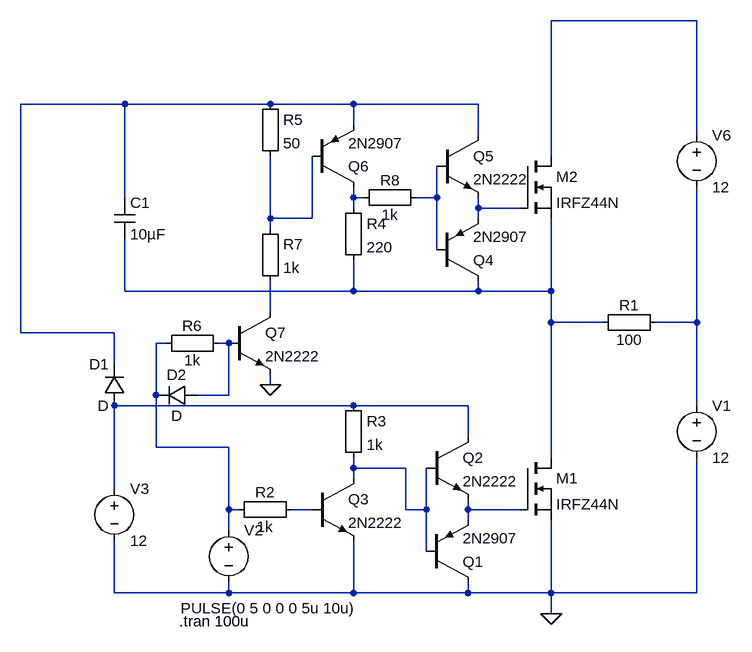
[diagram p0: schematic Drive6.asc]
Drive6.asc, the LTspice schematic file:
Version 4
SHEET 1 880 1388
WIRE -2688 448 -2912 448
WIRE -3568 576 -3728 576
WIRE -3344 576 -3568 576
WIRE -3216 576 -3344 576
WIRE -3024 576 -3216 576
WIRE -3216 608 -3216 576
WIRE -3024 624 -3024 576
WIRE -2688 624 -2688 448
WIRE -2912 656 -2912 448
WIRE -3568 720 -3568 576
WIRE -3216 720 -3216 704
WIRE -3200 720 -3216 720
WIRE -3088 720 -3088 672
WIRE -3088 720 -3120 720
WIRE -3216 736 -3216 720
WIRE -3024 736 -3024 720
WIRE -2960 736 -3024 736
WIRE -3344 752 -3344 656
WIRE -3280 752 -3280 656
WIRE -3280 752 -3344 752
WIRE -3024 752 -3024 736
WIRE -3344 768 -3344 752
WIRE -3088 800 -3088 720
WIRE -3568 864 -3568 784
WIRE -3216 864 -3216 816
WIRE -3216 864 -3568 864
WIRE -3024 864 -3024 848
WIRE -3024 864 -3216 864
WIRE -2912 864 -2912 752
WIRE -2912 864 -3024 864
WIRE -3344 896 -3344 848
WIRE -2912 912 -2912 864
WIRE -2832 912 -2912 912
WIRE -2688 912 -2688 704
WIRE -2688 912 -2752 912
WIRE -3728 928 -3728 576
WIRE -3584 928 -3728 928
WIRE -3504 944 -3520 944
WIRE -3408 944 -3424 944
WIRE -3584 976 -3584 928
WIRE -3344 1008 -3344 992
WIRE -3520 1024 -3520 944
WIRE -3408 1024 -3408 944
WIRE -3408 1024 -3456 1024
WIRE -3216 1040 -3584 1040
WIRE -3040 1040 -3216 1040
WIRE -2688 1040 -2688 912
WIRE -3040 1088 -3040 1040
WIRE -3520 1104 -3520 1024
WIRE -3408 1104 -3520 1104
WIRE -2912 1120 -2912 912
WIRE -3216 1136 -3216 1120
WIRE -3136 1136 -3216 1136
WIRE -3216 1152 -3216 1136
WIRE -3584 1168 -3584 1040
WIRE -3408 1200 -3408 1104
WIRE -3392 1200 -3408 1200
WIRE -3280 1200 -3312 1200
WIRE -3136 1200 -3136 1136
WIRE -3104 1200 -3104 1136
WIRE -3104 1200 -3136 1200
WIRE -3040 1200 -3040 1184
WIRE -2960 1200 -3040 1200
WIRE -3040 1216 -3040 1200
WIRE -3408 1232 -3408 1200
WIRE -3104 1264 -3104 1200
WIRE -3584 1328 -3584 1248
WIRE -3408 1328 -3408 1312
WIRE -3408 1328 -3584 1328
WIRE -3216 1328 -3216 1248
WIRE -3216 1328 -3408 1328
WIRE -3040 1328 -3040 1312
WIRE -3040 1328 -3216 1328
WIRE -2912 1328 -2912 1216
WIRE -2912 1328 -3040 1328
WIRE -2688 1328 -2688 1120
WIRE -2688 1328 -2912 1328
WIRE -2912 1360 -2912 1328
FLAG -2912 1360 0
FLAG -3344 1008 0
SYMBOL nmos -2960 1120 R0
SYMATTR InstName M1
SYMATTR Value IRFZ44N
SYMBOL voltage -2688 1024 R0
WINDOW 123 0 0 Left 0
WINDOW 39 0 0 Left 0
SYMATTR InstName V1
SYMATTR Value 12
SYMBOL Misc\\EuropeanResistor -2736 896 R90
WINDOW 0 5 56 VBottom 2
WINDOW 3 27 56 VTop 2
SYMATTR InstName R1
SYMATTR Value 100
SYMBOL Misc\\EuropeanResistor -3408 1216 R270
WINDOW 0 27 56 VTop 2
WINDOW 3 5 56 VBottom 2
SYMATTR InstName R2
SYMATTR Value 1k
SYMBOL voltage -3408 1216 R0
WINDOW 3 -74 136 Left 2
WINDOW 123 0 0 Left 0
WINDOW 39 0 0 Left 0
SYMATTR InstName V2
SYMATTR Value PULSE(0 5 0 0 0 5u 10u)
SYMBOL pnp -3104 1312 M180
SYMATTR InstName Q1
SYMATTR Value 2N2907
SYMBOL npn -3104 1088 R0
SYMATTR InstName Q2
SYMATTR Value 2N2222
SYMBOL voltage -3584 1152 R0
WINDOW 123 0 0 Left 0
WINDOW 39 0 0 Left 0
SYMATTR InstName V3
SYMATTR Value 12
SYMBOL Misc\\EuropeanResistor -3232 1024 R0
SYMATTR InstName R3
SYMATTR Value 1k
SYMBOL npn -3280 1152 R0
SYMATTR InstName Q3
SYMATTR Value 2N2222
SYMBOL nmos -2960 656 R0
SYMATTR InstName M2
SYMATTR Value IRFZ44N
SYMBOL pnp -3088 848 M180
SYMATTR InstName Q4
SYMATTR Value 2N2907
SYMBOL npn -3088 624 R0
SYMATTR InstName Q5
SYMATTR Value 2N2222
SYMBOL voltage -2688 608 R0
WINDOW 123 0 0 Left 0
WINDOW 39 0 0 Left 0
SYMATTR InstName V6
SYMATTR Value 12
SYMBOL cap -3584 720 R0
SYMATTR InstName C1
SYMATTR Value 10µF
SYMBOL diode -3568 1040 R180
WINDOW 0 24 64 Left 2
WINDOW 3 24 0 Left 2
SYMATTR InstName D1
SYMBOL pnp -3280 704 M180
SYMATTR InstName Q6
SYMATTR Value 2N2907
SYMBOL Misc\\EuropeanResistor -3232 720 R0
SYMATTR InstName R4
SYMATTR Value 220
SYMBOL Misc\\EuropeanResistor -3360 560 R0
SYMATTR InstName R5
SYMATTR Value 50
SYMBOL npn -3408 896 R0
SYMATTR InstName Q7
SYMATTR Value 2N2222
SYMBOL Misc\\EuropeanResistor -3520 960 R270
WINDOW 0 27 56 VTop 2
WINDOW 3 5 56 VBottom 2
SYMATTR InstName R6
SYMATTR Value 1k
SYMBOL Misc\\EuropeanResistor -3360 752 R0
SYMATTR InstName R7
SYMATTR Value 1k
SYMBOL Misc\\EuropeanResistor -3104 704 R90
WINDOW 0 5 56 VBottom 2
WINDOW 3 27 56 VTop 2
SYMATTR InstName R8
SYMATTR Value 1k
SYMBOL diode -3456 1008 R90
WINDOW 0 0 32 VBottom 2
WINDOW 3 32 32 VTop 2
SYMATTR InstName D2
TEXT -3484 1372 Left 2 !.tran 100u

The netlist it stands for:
* Drive6.asc
M1 N007 N015 0 0 IRFZ44N
V1 N009 0 12
R1 N009 N007 100
R2 N010 N014 1k
V2 N010 0 PULSE(0 5 0 0 0 5u 10u)
Q1 0 N013 N015 0 2N2907
Q2 N012 N013 N015 0 2N2222
V3 N012 0 12
R3 N012 N013 1k
Q3 N013 N014 0 0 2N2222
M2 N001 N005 N007 N007 IRFZ44N
Q4 N007 N004 N005 0 2N2907
Q5 N002 N004 N005 0 2N2222
V6 N001 N009 12
C1 N002 N007 10µF
D1 N012 N002 D
Q6 N003 N006 N002 0 2N2907
R4 N003 N007 220
R5 N002 N006 50
Q7 N008 N011 0 0 2N2222
R6 N010 N011 1k
R7 N006 N008 1k
R8 N004 N003 1k
D2 N011 N010 D
.model D D
.lib standard.dio
.model NPN NPN
.model PNP PNP
.lib standard.bjt
.model NMOS NMOS
.model PMOS PMOS
.lib standard.mos
.tran 100u
.backanno
.end